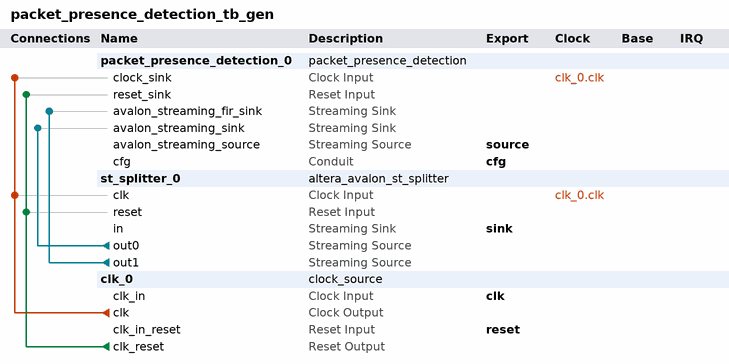
[diagram p0: system contents]
# Platform Designer (Qsys) system packet_presence_detection_tb_gen, MAX 10 10M16SAU169C8G
# Parameters at their usual value, and those the tool derives, are not listed.
package require -exact qsys 18.1
create_system packet_presence_detection_tb_gen
set_project_property DEVICE_FAMILY {MAX 10}
set_project_property DEVICE 10M16SAU169C8G

add_instance packet_presence_detection_0 packet_presence_detection 1.0
set_instance_parameter_value packet_presence_detection_0 DATA_WIDTH 12
set_instance_parameter_value packet_presence_detection_0 PASSTHROUGH_LEN_WIDTH 16

add_instance st_splitter_0 altera_avalon_st_splitter 18.1
set_instance_parameter_value st_splitter_0 BITS_PER_SYMBOL 12
set_instance_parameter_value st_splitter_0 CHANNEL_WIDTH 1
set_instance_parameter_value st_splitter_0 DATA_WIDTH 24
set_instance_parameter_value st_splitter_0 ERROR_WIDTH 1
set_instance_parameter_value st_splitter_0 MAX_CHANNELS 1
set_instance_parameter_value st_splitter_0 NUMBER_OF_OUTPUTS 2
set_instance_parameter_value st_splitter_0 QUALIFY_VALID_OUT 0
set_instance_parameter_value st_splitter_0 READY_LATENCY 0
set_instance_parameter_value st_splitter_0 USE_CHANNEL 0
set_instance_parameter_value st_splitter_0 USE_DATA 1
set_instance_parameter_value st_splitter_0 USE_ERROR 0
set_instance_parameter_value st_splitter_0 USE_PACKETS 0
set_instance_parameter_value st_splitter_0 USE_READY 0
set_instance_parameter_value st_splitter_0 USE_VALID 1

add_instance clk_0 clock_source 18.1
set_instance_parameter_value clk_0 clockFrequency 50000000

# connections
add_connection clk_0.clk packet_presence_detection_0.clock_sink clock
add_connection clk_0.clk st_splitter_0.clk clock
add_connection clk_0.clk_reset packet_presence_detection_0.reset_sink reset
add_connection clk_0.clk_reset st_splitter_0.reset reset
add_connection st_splitter_0.out0 packet_presence_detection_0.avalon_streaming_sink avalon_streaming
add_connection st_splitter_0.out1 packet_presence_detection_0.avalon_streaming_fir_sink avalon_streaming

# exported interfaces
add_interface cfg conduit end
set_interface_property cfg EXPORT_OF packet_presence_detection_0.cfg
add_interface clk clock sink
set_interface_property clk EXPORT_OF clk_0.clk_in
add_interface reset reset sink
set_interface_property reset EXPORT_OF clk_0.clk_in_reset
add_interface sink avalon_streaming sink
set_interface_property sink EXPORT_OF st_splitter_0.in
add_interface source avalon_streaming source
set_interface_property source EXPORT_OF packet_presence_detection_0.avalon_streaming_source

set_interconnect_requirement {$system} qsys_mm.clockCrossingAdapter HANDSHAKE
set_interconnect_requirement {$system} qsys_mm.enableEccProtection FALSE
set_interconnect_requirement {$system} qsys_mm.insertDefaultSlave FALSE
set_interconnect_requirement {$system} qsys_mm.maxAdditionalLatency 1

save_system packet_presence_detection_tb_gen.qsys
